# Altium schematic sheet Clock_Buffers.SchDoc
size A4 portrait
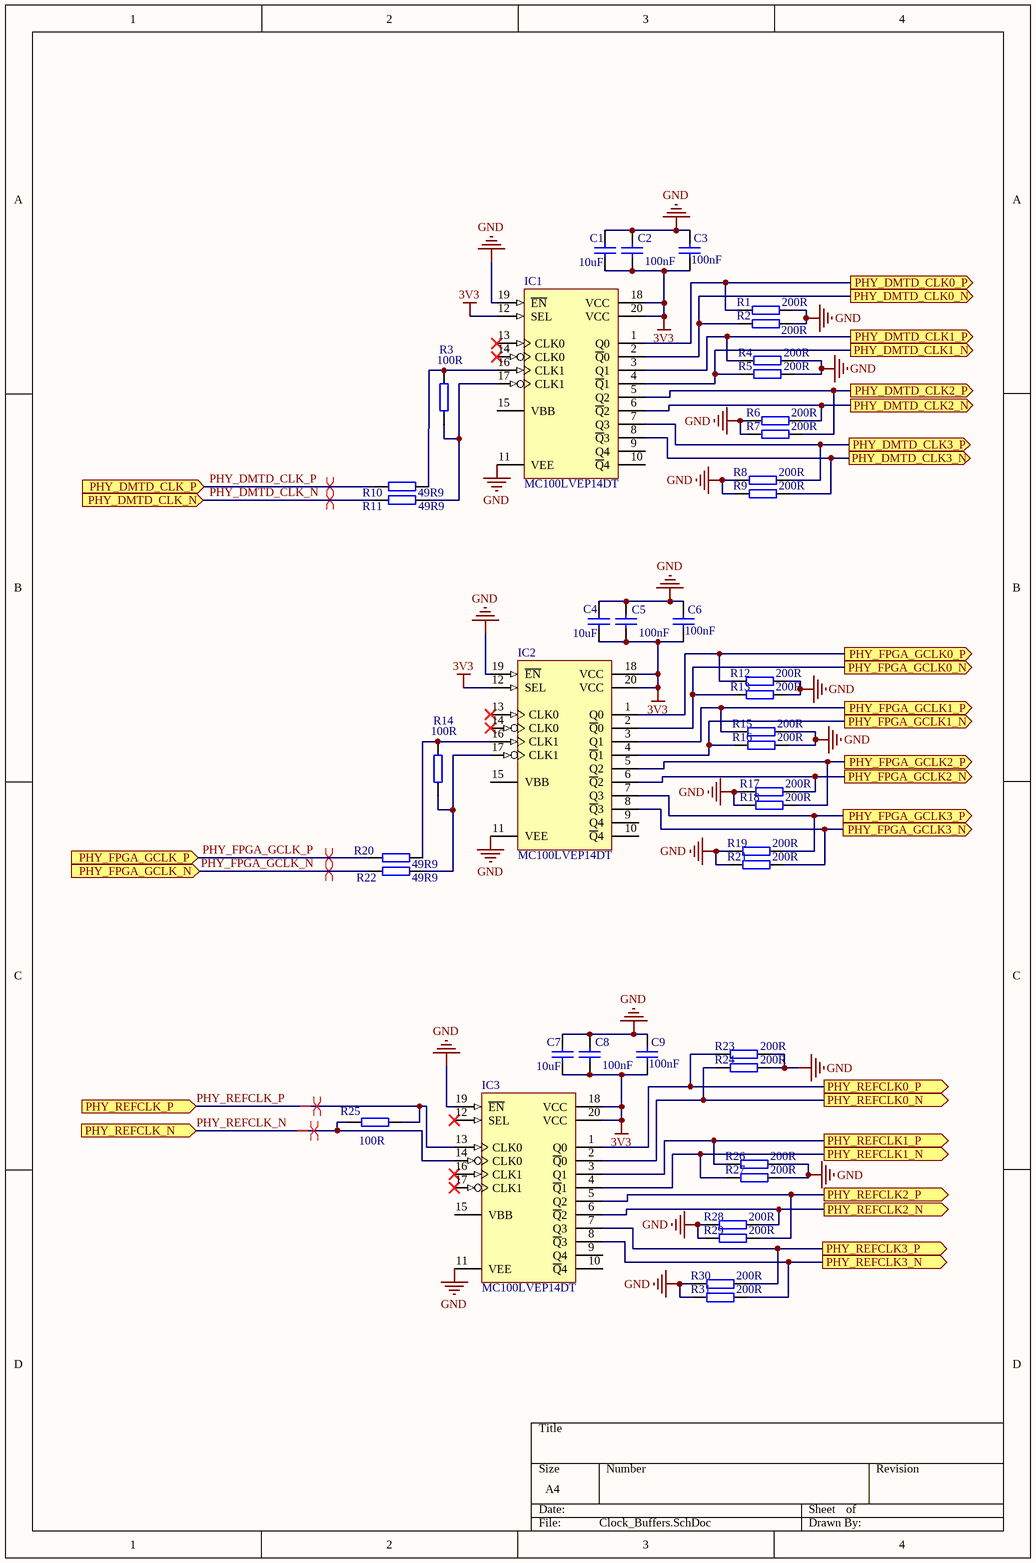
[diagram p0: Clock_Buffers.SchDoc]

## Parts
C1  10uF  [CC1608-0603]
C2  100nF  [CC1608-0603]
C3  100nF  [CC1608-0603]
C4  10uF  [CC1608-0603]
C5  100nF  [CC1608-0603]
C6  100nF  [CC1608-0603]
C7  10uF  [CC1608-0603]
C8  100nF  [CC1608-0603]
C9  100nF  [CC1608-0603]
IC1  MC100LVEP14DT  [948E-02_N]
IC2  MC100LVEP14DT  [948E-02_N]
IC3  MC100LVEP14DT  [948E-02_N]
R1  200R  [0603]
R2  200R  [0603]
R3  100R  [0603]
R4  200R  [0603]
R5  200R  [0603]
R6  200R  [0603]
R7  200R  [0603]
R8  200R  [0603]
R9  200R  [0603]
R10  49R9  [0603]
R11  49R9  [0603]
R12  200R  [0603]
R13  200R  [0603]
R14  100R  [0603]
R15  200R  [0603]
R16  200R  [0603]
R17  200R  [0603]
R18  200R  [0603]
R19  200R  [0603]
R20  49R9  [0603]
R21  200R  [0603]
R22  49R9  [0603]
R23  200R  [0603]
R24  200R  [0603]
R25  100R  [0603]
R26  200R  [0603]
R27  200R  [0603]
R28  200R  [0603]
R29  200R  [0603]
R30  200R  [0603]
R31  200R  [0603]

## Ports
PHY_DMTD_CLK0_N (out), PHY_DMTD_CLK0_P (out), PHY_DMTD_CLK1_N (out), PHY_DMTD_CLK1_P (out), PHY_DMTD_CLK2_N (out), PHY_DMTD_CLK2_P (out), PHY_DMTD_CLK3_N (out), PHY_DMTD_CLK3_P (out), PHY_DMTD_CLK_N (in), PHY_DMTD_CLK_P (in), PHY_FPGA_GCLK0_N (out), PHY_FPGA_GCLK0_P (out), PHY_FPGA_GCLK1_N (out), PHY_FPGA_GCLK1_P (out), PHY_FPGA_GCLK2_N (out), PHY_FPGA_GCLK2_P (out), PHY_FPGA_GCLK3_N (out), PHY_FPGA_GCLK3_P (out), PHY_FPGA_GCLK_N (in), PHY_FPGA_GCLK_P (in), PHY_REFCLK0_N (out), PHY_REFCLK0_P (out), PHY_REFCLK1_N (out), PHY_REFCLK1_P (out), PHY_REFCLK2_N (out), PHY_REFCLK2_P (out), PHY_REFCLK3_N (out), PHY_REFCLK3_P (out), PHY_REFCLK_N (in), PHY_REFCLK_P (in)

## Nets
3V3: C1.2 C2.2 C3.2 C4.2 C5.2 C6.2 C7.2 C8.2 C9.2 IC1.12(SEL) IC1.18(VCC) IC1.20(VCC) IC2.12(SEL) IC2.18(VCC) IC2.20(VCC) IC3.18(VCC) IC3.20(VCC)
GND: C1.1 C2.1 C3.1 C4.1 C5.1 C6.1 C7.1 C8.1 C9.1 IC1.11(VEE) IC1.19(~{EN}) IC2.11(VEE) IC2.19(~{EN}) IC3.11(VEE) IC3.19(~{EN}) R1.2 R2.2 R4.2 R5.2 R6.1 R7.1 R8.1 R9.1 R12.2 R13.2 R15.2 R16.2 R17.1 R18.1 R19.1 R21.1 R23.2 R24.2 R26.2 R27.2 R28.1 R29.1 R30.1 R31.1
PHY_DMTD_CLK0_N: IC1.2(~{Q}0) R2.1 ; port PHY_DMTD_CLK0_N
PHY_DMTD_CLK0_P: IC1.1(Q0) R1.1 ; port PHY_DMTD_CLK0_P
PHY_DMTD_CLK1_N: IC1.4(~{Q}1) R5.1 ; port PHY_DMTD_CLK1_N
PHY_DMTD_CLK1_P: IC1.3(Q1) R4.1 ; port PHY_DMTD_CLK1_P
PHY_DMTD_CLK2_N: IC1.6(~{Q}2) R6.2 ; port PHY_DMTD_CLK2_N
PHY_DMTD_CLK2_P: IC1.5(Q2) R7.2 ; port PHY_DMTD_CLK2_P
PHY_DMTD_CLK3_N: IC1.8(~{Q}3) R9.2 ; port PHY_DMTD_CLK3_N
PHY_DMTD_CLK3_P: IC1.7(Q3) R8.2 ; port PHY_DMTD_CLK3_P
PHY_DMTD_CLK_N: R11.1 ; port PHY_DMTD_CLK_N
PHY_DMTD_CLK_P: R10.1 ; port PHY_DMTD_CLK_P
PHY_FPGA_GCLK0_N: IC2.2(~{Q}0) R13.1 ; port PHY_FPGA_GCLK0_N
PHY_FPGA_GCLK0_P: IC2.1(Q0) R12.1 ; port PHY_FPGA_GCLK0_P
PHY_FPGA_GCLK1_N: IC2.4(~{Q}1) R16.1 ; port PHY_FPGA_GCLK1_N
PHY_FPGA_GCLK1_P: IC2.3(Q1) R15.1 ; port PHY_FPGA_GCLK1_P
PHY_FPGA_GCLK2_N: IC2.6(~{Q}2) R17.2 ; port PHY_FPGA_GCLK2_N
PHY_FPGA_GCLK2_P: IC2.5(Q2) R18.2 ; port PHY_FPGA_GCLK2_P
PHY_FPGA_GCLK3_N: IC2.8(~{Q}3) R21.2 ; port PHY_FPGA_GCLK3_N
PHY_FPGA_GCLK3_P: IC2.7(Q3) R19.2 ; port PHY_FPGA_GCLK3_P
PHY_FPGA_GCLK_N: R22.1 ; port PHY_FPGA_GCLK_N
PHY_FPGA_GCLK_P: R20.1 ; port PHY_FPGA_GCLK_P
PHY_REFCLK0_N: IC3.2(~{Q}0) R24.1 ; port PHY_REFCLK0_N
PHY_REFCLK0_P: IC3.1(Q0) R23.1 ; port PHY_REFCLK0_P
PHY_REFCLK1_N: IC3.4(~{Q}1) R27.1 ; port PHY_REFCLK1_N
PHY_REFCLK1_P: IC3.3(Q1) R26.1 ; port PHY_REFCLK1_P
PHY_REFCLK2_N: IC3.6(~{Q}2) R28.2 ; port PHY_REFCLK2_N
PHY_REFCLK2_P: IC3.5(Q2) R29.2 ; port PHY_REFCLK2_P
PHY_REFCLK3_N: IC3.8(~{Q}3) R31.2 ; port PHY_REFCLK3_N
PHY_REFCLK3_P: IC3.7(Q3) R30.2 ; port PHY_REFCLK3_P
PHY_REFCLK_N: IC3.14(CLK0) R25.2 ; port PHY_REFCLK_N
PHY_REFCLK_P: IC3.13(CLK0) R25.1 ; port PHY_REFCLK_P
NetIC1_16: IC1.16(CLK1) R3.2 R10.2
NetIC1_17: IC1.17(CLK1) R3.1 R11.2
NetIC2_16: IC2.16(CLK1) R14.2 R20.2
NetIC2_17: IC2.17(CLK1) R14.1 R22.2

Not connected (* = marked no-connect by the designer): IC1 9(Q4) 10(~{Q}4) 13(CLK0)* 14(CLK0)* 15(VBB); IC2 9(Q4) 10(~{Q}4) 13(CLK0)* 14(CLK0)* 15(VBB); IC3 9(Q4) 10(~{Q}4) 12(SEL)* 15(VBB) 16(CLK1)* 17(CLK1)*

## Layout directives
differential pair: PHY_DMTD_CLK_N, PHY_DMTD_CLK_P, PHY_FPGA_GCLK_N, PHY_FPGA_GCLK_P, PHY_REFCLK_N, PHY_REFCLK_P

## Library data of the parts
C1 C4 C7 = CC0603_10UF_6.3V_20%_X5R: Capacitor; Manufacturer1: TDK; Manufacturer1 PN: C1608X5R0J106M; TC: X5R; Tolerance: ±20%; Voltage: 6.3V; Published: 8-Jun-2000; LatestRevisionDate: 17-Jul-2002; LatestRevisionNote: Re-released for DXP Platform.; PackageReference: RAD-0.3; Publisher: Altium Limited; Distributor1: Digikey; Distributor1 PN: 445-4112-1-ND; Case: 0603; Value: 10uF
C2 C3 C5 C6 C8 C9 = CC0603_100NF_16V_10%_X7R: Capacitor; Manufacturer1: AVX; Manufacturer1 PN: 0603YC104KAT2A; TC: X7R; Tolerance: ±10%; Voltage: 16V; Published: 8-Jun-2000; LatestRevisionDate: 17-Jul-2002; LatestRevisionNote: Re-released for DXP Platform.; PackageReference: RAD-0.3; Publisher: Altium Limited; Distributor1: Digikey; Distributor1 PN: 478-1239-1-ND; Case: 0603; Value: 100nF
IC1-IC3 = MC100LVEP14DT: Low-Voltage 1:5 Differential LVECL/LVPECL/LVEPECL/HSTL Clock Driver; Published: 15-Apr-2002; LatestRevisionDate: 12-Dec-2006; LatestRevisionNote: IPC-7351 Footprint Added.; DatasheetVersion: Jan-2000; PackageVersion: Mar-2000; PackageReference: 948E-02; Publisher: Altium Limited; PackageDescription: 20-Pin Thin Small Outline Package 0.65 mm Pitch; ComponentLink1Description: Manufacturer Link; ComponentLink1URL: http://www.onsemi.com/; ComponentLink2Description: Datasheet; ComponentLink2URL: http://www.onsemi.com/pub/Collateral/MC100LVEP14-D.PDF
R1 R2 R4-R9 R12 R13 R15-R19 R21 R23 R24 R26-R31 = R0603_200R_±1%_0.1W_100PPM: SMD Resistor; Manufacturer1: Yageo; Manufacturer1 PN: RC0603FR-07200RL; TCR: 100ppm; Power Rating: 0.1W; Tolerance: ±1%; Case: 0603; Distributor1: DigiKey; Distributor1 PN: 311-200HRCT-ND; Value: 200R
R3 R14 R25 = R0603_100R_±1%_0.1W_100PPM: SMD Resistor; Manufacturer1: Yageo; Manufacturer1 PN: RC0603FR-07100RL; TCR: 100ppm; Power Rating: 0.1W; Tolerance: ±1%; Case: 0603; Distributor1: DigiKey; Distributor1 PN: 311-100HRCT-ND; Value: 100R
R10 R11 R20 R22 = R0603_49R9_±1%_0.25W_100PPM: SMD Resistor; Manufacturer1: Vishay/Dale; Manufacturer1 PN: CRCW060349R9FKEAHP; TCR: 100ppm; Power Rating: 0.25W; Tolerance: ±1%; Case: 0603; Distributor1: DigiKey; Distributor1 PN: 541-49.9SCT-ND; Value: 49R9